# EAGLE schematic Wiring harness pinout (EAGLE 7.5.0)
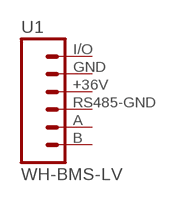
[diagram p0: schematic, sheet 1]

## Parts
U1  WH-BMS-LV  [WH-BMS-LV]
Unconnected: U1.+36V U1.A U1.B U1.GND U1.I/O U1.RS485-GND

## Library data of the parts
U1 = FSAE Electric:WH-BMS-LV